# Altium schematic sheet 4bit_decoder.SchDoc
size OrCAD D; SheetNumber: 1; SheetTotal: 1
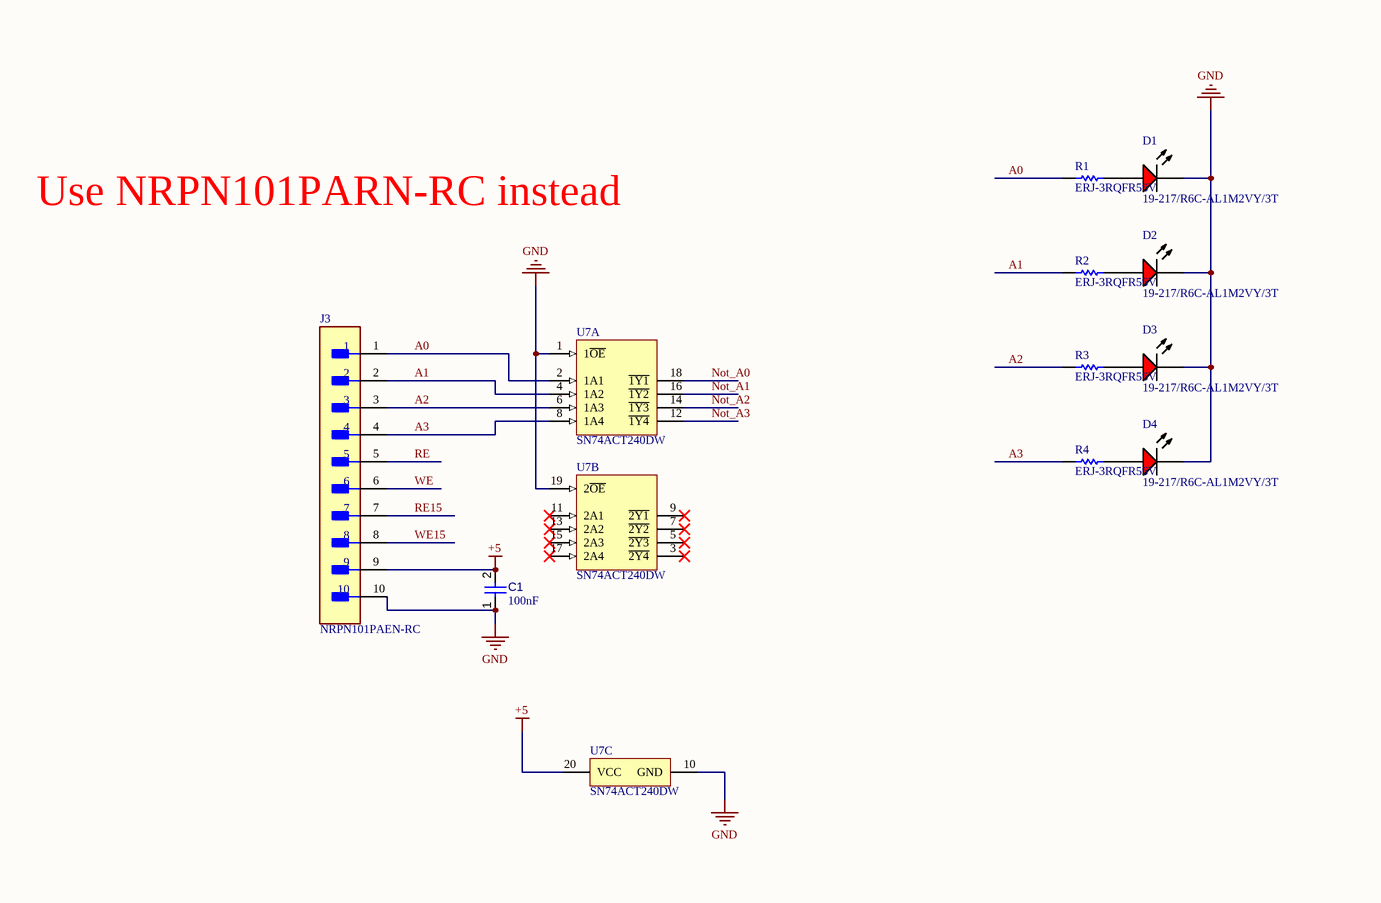
[diagram p0: 4bit_decoder.SchDoc, top left]
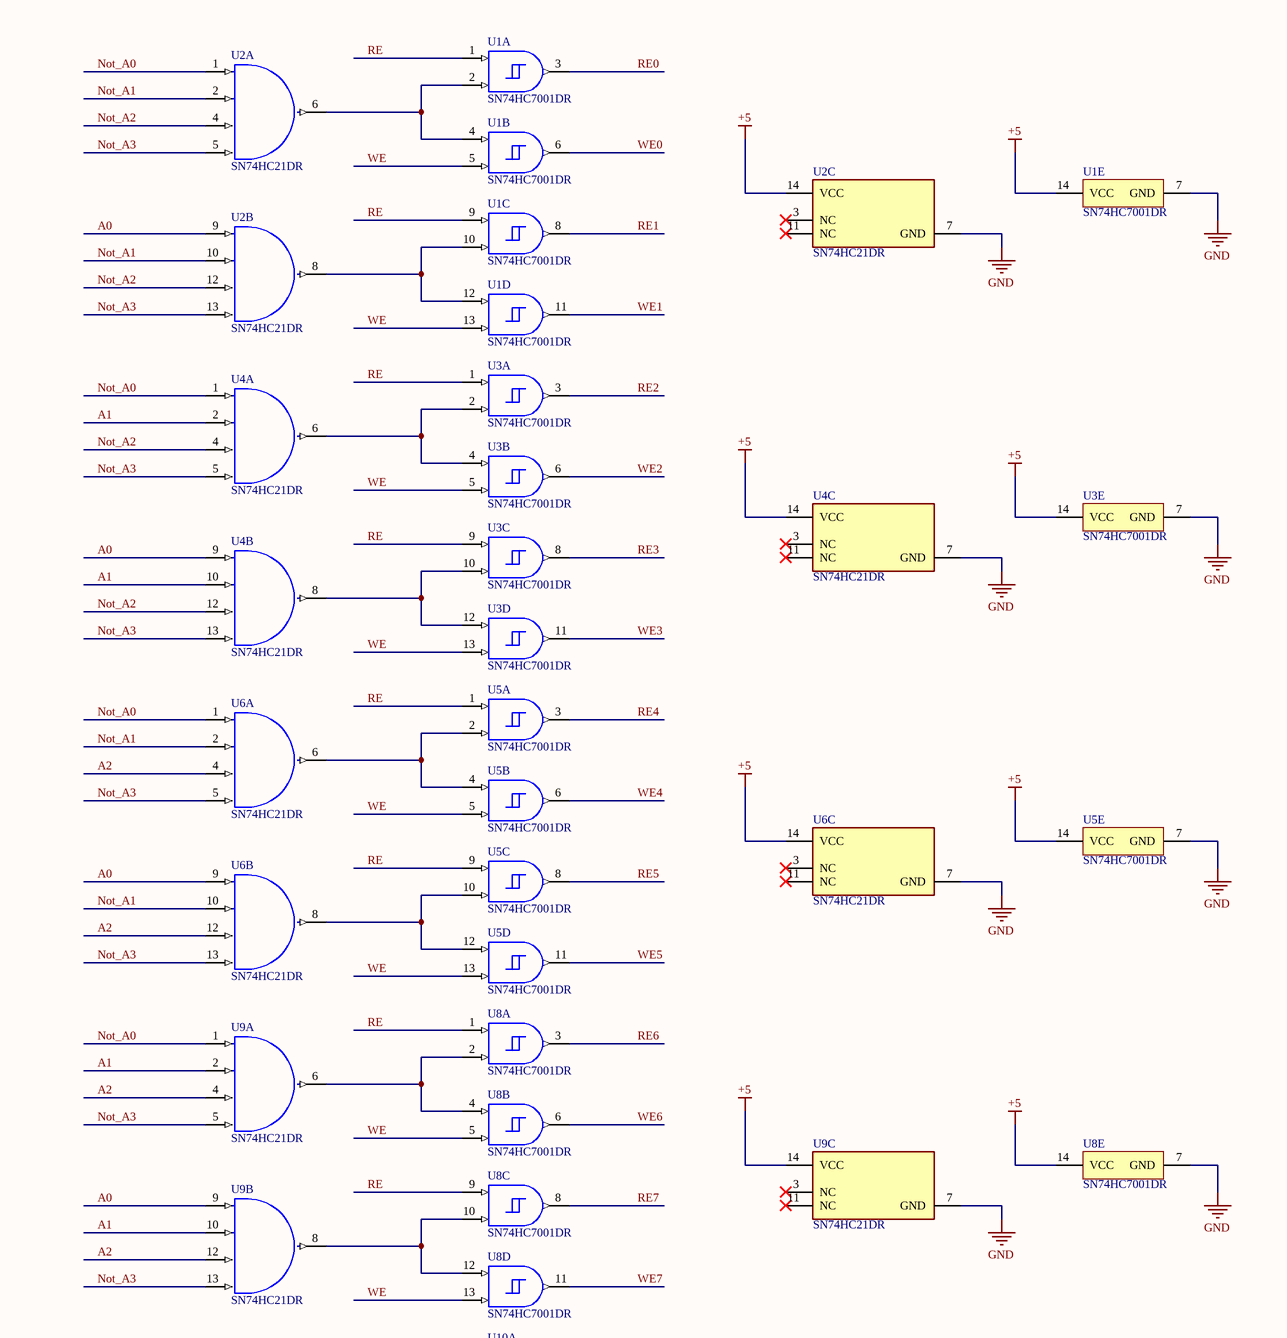
[diagram p1: 4bit_decoder.SchDoc, top middle]
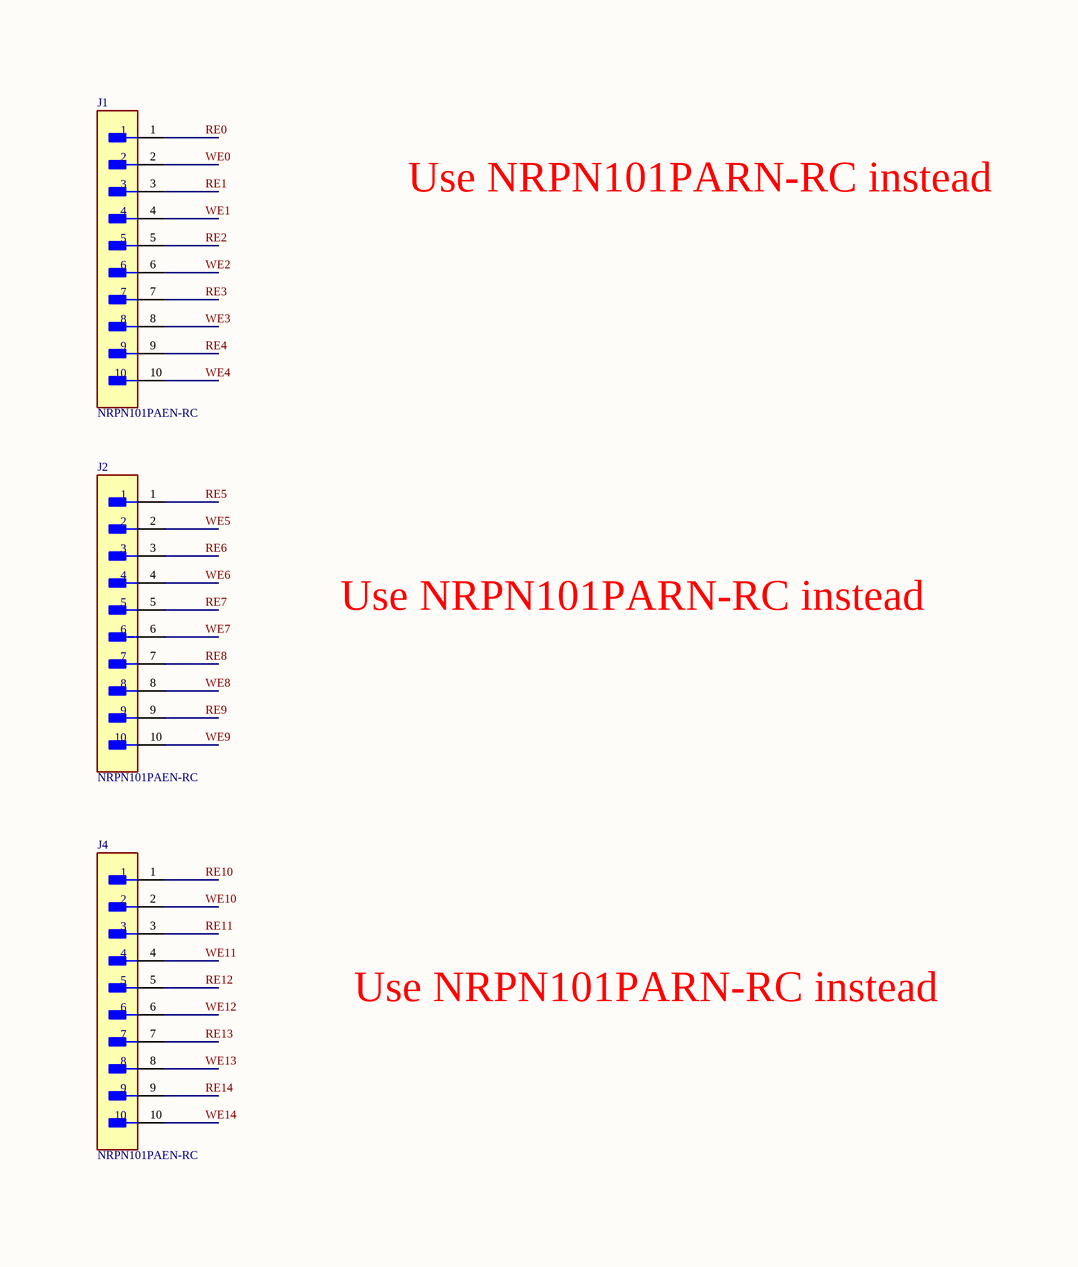
[diagram p2: 4bit_decoder.SchDoc, top right]
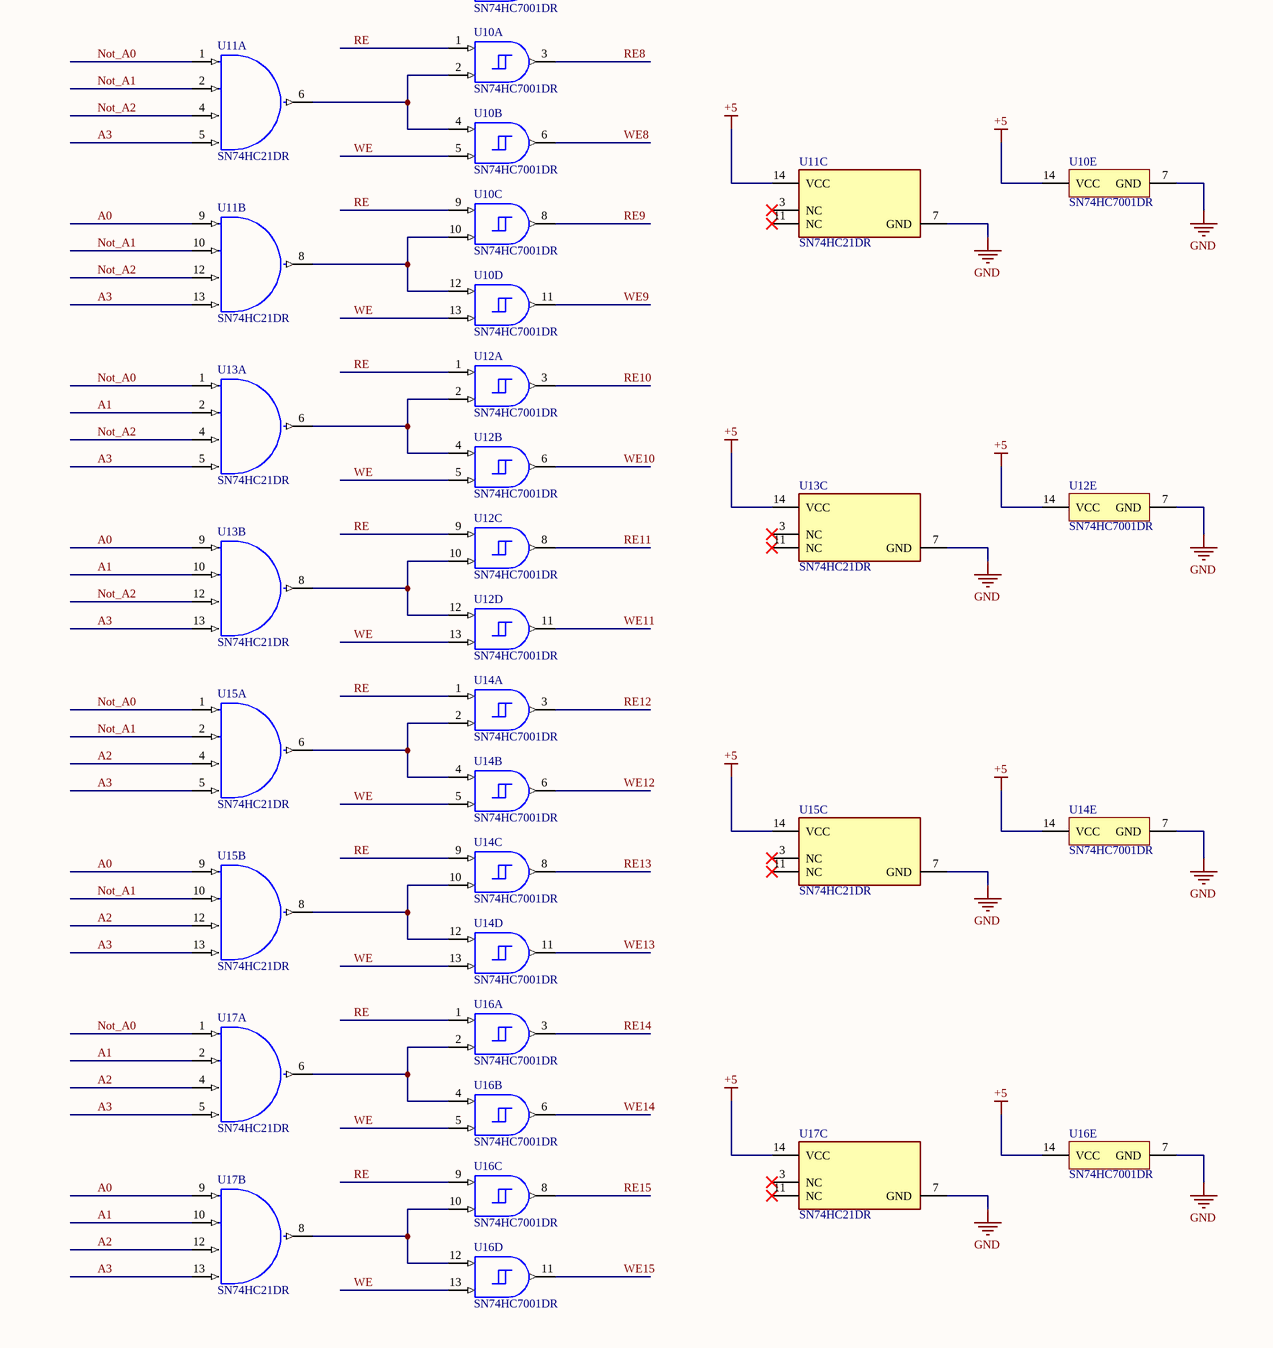
[diagram p3: 4bit_decoder.SchDoc, bottom middle]

## Parts
C1  value 100nF  [CAPC1608X90X40NL10T20]  (hidden comment: Capacitor 100 nF +/-10% 50 V 0603)
D1  19-217/R6C-AL1M2VY/3T  [EVRL-0603-2_V]
D2  19-217/R6C-AL1M2VY/3T  [EVRL-0603-2_V]
D3  19-217/R6C-AL1M2VY/3T  [EVRL-0603-2_V]
D4  19-217/R6C-AL1M2VY/3T  [EVRL-0603-2_V]
J1  NRPN101PAEN-RC  [FP-NRPN101PAEN-RC-MFG]
J2  NRPN101PAEN-RC  [FP-NRPN101PAEN-RC-MFG]
J3  NRPN101PAEN-RC  [FP-NRPN101PAEN-RC-MFG]
J4  NRPN101PAEN-RC  [FP-NRPN101PAEN-RC-MFG]
R1  ERJ-3RQFR56V  [RESC1608X55X30NL15T15]
R2  ERJ-3RQFR56V  [RESC1608X55X30NL15T15]
R3  ERJ-3RQFR56V  [RESC1608X55X30NL15T15]
R4  ERJ-3RQFR56V  [RESC1608X55X30NL15T15]
U1  SN74HC7001DR  [D0014A_L]  (parts A,B,C,D,E of 5)
U2  SN74HC21DR  [FP-D0014A-MFG]  (parts A,B,C of 3)
U3  SN74HC7001DR  [D0014A_L]  (parts A,B,C,D,E of 5)
U4  SN74HC21DR  [FP-D0014A-MFG]  (parts A,B,C of 3)
U5  SN74HC7001DR  [D0014A_L]  (parts A,B,C,D,E of 5)
U6  SN74HC21DR  [FP-D0014A-MFG]  (parts A,B,C of 3)
U7  SN74ACT240DW  [DW0020A_M]  (parts A,B,C of 3)
U8  SN74HC7001DR  [D0014A_L]  (parts A,B,C,D,E of 5)
U9  SN74HC21DR  [FP-D0014A-MFG]  (parts A,B,C of 3)
U10  SN74HC7001DR  [D0014A_L]  (parts A,B,C,D,E of 5)
U11  SN74HC21DR  [FP-D0014A-MFG]  (parts A,B,C of 3)
U12  SN74HC7001DR  [D0014A_L]  (parts A,B,C,D,E of 5)
U13  SN74HC21DR  [FP-D0014A-MFG]  (parts A,B,C of 3)
U14  SN74HC7001DR  [D0014A_L]  (parts A,B,C,D,E of 5)
U15  SN74HC21DR  [FP-D0014A-MFG]  (parts A,B,C of 3)
U16  SN74HC7001DR  [D0014A_L]  (parts A,B,C,D,E of 5)
U17  SN74HC21DR  [FP-D0014A-MFG]  (parts A,B,C of 3)

## Nets
+5: C1.2 J3.9 U1.14(VCC) U2.14(VCC) U3.14(VCC) U4.14(VCC) U5.14(VCC) U6.14(VCC) U7.20(VCC) U8.14(VCC) U9.14(VCC) U10.14(VCC) U11.14(VCC) U12.14(VCC) U13.14(VCC) U14.14(VCC) U15.14(VCC) U16.14(VCC) U17.14(VCC)
GND: C1.1 D1.2(K) D2.2(K) D3.2(K) D4.2(K) J3.10 U1.7(GND) U2.7(GND) U3.7(GND) U4.7(GND) U5.7(GND) U6.7(GND) U7.1(1~{OE}) U7.10(GND) U7.19(2~{OE}) U8.7(GND) U9.7(GND) U10.7(GND) U11.7(GND) U12.7(GND) U13.7(GND) U14.7(GND) U15.7(GND) U16.7(GND) U17.7(GND)
A0: J3.1 R1.1 U2.9(2A) U4.9(2A) U6.9(2A) U7.2(1A1) U9.9(2A) U11.9(2A) U13.9(2A) U15.9(2A) U17.9(2A)
A1: J3.2 R2.1 U4.2(1B) U4.10(2B) U7.4(1A2) U9.2(1B) U9.10(2B) U13.2(1B) U13.10(2B) U17.2(1B) U17.10(2B)
A2: J3.3 R3.1 U6.4(1C) U6.12(2C) U7.6(1A3) U9.4(1C) U9.12(2C) U15.4(1C) U15.12(2C) U17.4(1C) U17.12(2C)
A3: J3.4 R4.1 U7.8(1A4) U11.5(1D) U11.13(2D) U13.5(1D) U13.13(2D) U15.5(1D) U15.13(2D) U17.5(1D) U17.13(2D)
Not_A0: U2.1(1A) U4.1(1A) U6.1(1A) U7.18(~{1Y1}) U9.1(1A) U11.1(1A) U13.1(1A) U15.1(1A) U17.1(1A)
Not_A1: U2.2(1B) U2.10(2B) U6.2(1B) U6.10(2B) U7.16(~{1Y2}) U11.2(1B) U11.10(2B) U15.2(1B) U15.10(2B)
Not_A2: U2.4(1C) U2.12(2C) U4.4(1C) U4.12(2C) U7.14(~{1Y3}) U11.4(1C) U11.12(2C) U13.4(1C) U13.12(2C)
Not_A3: U2.5(1D) U2.13(2D) U4.5(1D) U4.13(2D) U6.5(1D) U6.13(2D) U7.12(~{1Y4}) U9.5(1D) U9.13(2D)
RE: J3.5 U1.1(1A) U1.9(3A) U3.1(1A) U3.9(3A) U5.1(1A) U5.9(3A) U8.1(1A) U8.9(3A) U10.1(1A) U10.9(3A) U12.1(1A) U12.9(3A) U14.1(1A) U14.9(3A) U16.1(1A) U16.9(3A)
RE0: J1.1 U1.3(1Y)
RE1: J1.3 U1.8(3Y)
RE2: J1.5 U3.3(1Y)
RE3: J1.7 U3.8(3Y)
RE4: J1.9 U5.3(1Y)
RE5: J2.1 U5.8(3Y)
RE6: J2.3 U8.3(1Y)
RE7: J2.5 U8.8(3Y)
RE8: J2.7 U10.3(1Y)
RE9: J2.9 U10.8(3Y)
RE10: J4.1 U12.3(1Y)
RE11: J4.3 U12.8(3Y)
RE12: J4.5 U14.3(1Y)
RE13: J4.7 U14.8(3Y)
RE14: J4.9 U16.3(1Y)
RE15: J3.7 U16.8(3Y)
WE: J3.6 U1.5(2B) U1.13(4B) U3.5(2B) U3.13(4B) U5.5(2B) U5.13(4B) U8.5(2B) U8.13(4B) U10.5(2B) U10.13(4B) U12.5(2B) U12.13(4B) U14.5(2B) U14.13(4B) U16.5(2B) U16.13(4B)
WE0: J1.2 U1.6(2Y)
WE1: J1.4 U1.11(4Y)
WE2: J1.6 U3.6(2Y)
WE3: J1.8 U3.11(4Y)
WE4: J1.10 U5.6(2Y)
WE5: J2.2 U5.11(4Y)
WE6: J2.4 U8.6(2Y)
WE7: J2.6 U8.11(4Y)
WE8: J2.8 U10.6(2Y)
WE9: J2.10 U10.11(4Y)
WE10: J4.2 U12.6(2Y)
WE11: J4.4 U12.11(4Y)
WE12: J4.6 U14.6(2Y)
WE13: J4.8 U14.11(4Y)
WE14: J4.10 U16.6(2Y)
WE15: J3.8 U16.11(4Y)
NetD1_1: D1.1(A) R1.2
NetD2_1: D2.1(A) R2.2
NetD3_1: D3.1(A) R3.2
NetD4_1: D4.1(A) R4.2
NetU1_2: U1.2(1B) U1.4(2A) U2.6(1Y)
NetU1_10: U1.10(3B) U1.12(4A) U2.8(2Y)
NetU3_2: U3.2(1B) U3.4(2A) U4.6(1Y)
NetU3_10: U3.10(3B) U3.12(4A) U4.8(2Y)
NetU5_2: U5.2(1B) U5.4(2A) U6.6(1Y)
NetU5_10: U5.10(3B) U5.12(4A) U6.8(2Y)
NetU8_2: U8.2(1B) U8.4(2A) U9.6(1Y)
NetU8_10: U8.10(3B) U8.12(4A) U9.8(2Y)
NetU10_2: U10.2(1B) U10.4(2A) U11.6(1Y)
NetU10_10: U10.10(3B) U10.12(4A) U11.8(2Y)
NetU12_2: U12.2(1B) U12.4(2A) U13.6(1Y)
NetU12_10: U12.10(3B) U12.12(4A) U13.8(2Y)
NetU14_2: U14.2(1B) U14.4(2A) U15.6(1Y)
NetU14_10: U14.10(3B) U14.12(4A) U15.8(2Y)
NetU16_2: U16.2(1B) U16.4(2A) U17.6(1Y)
NetU16_10: U16.10(3B) U16.12(4A) U17.8(2Y)

Not connected (* = marked no-connect by the designer): U2 3(NC)* 11(NC)*; U4 3(NC)* 11(NC)*; U6 3(NC)* 11(NC)*; U7 3(~{2Y4})* 5(~{2Y3})* 7(~{2Y2})* 9(~{2Y1})* 11(2A1)* 13(2A2)* 15(2A3)* 17(2A4)*; U9 3(NC)* 11(NC)*; U11 3(NC)* 11(NC)*; U13 3(NC)* 11(NC)*; U15 3(NC)* 11(NC)*; U17 3(NC)* 11(NC)*

## Notes on the sheet
- Use NRPN101PARN-RC instead

## Library data of the parts
C1 = CMP-001-00017-6: Chip Capacitor, 100 nF, +/- 10%, 50 V, 0603 (1608 Metric); Voltage Rating: 50V; Capacitor Type: Ceramic; Tolerance: 10%; Mounting Technology: SM; Max Operating Temperature: 125°C; RoHS Compliant: True; Pins: 2; Case/Package: 0603; Min Operating Temperature: -55°C
D1-D4 = CMP-007-00004-2: Chip LED, Red, 5 V, 25 mA, -40 to 85 degC, 2-Pin SMD (0603), RoHS, Tape and Reel; Manufacturer: Everlight Electronics; Forward Voltage: 2.2V; Lens Style: Clear; Package Reference: 0603; Datasheet Version: Rev. 1, 01/2005; Mounting Technology: SM; RoHS Compliant: False; Datasheet URL: https://datasheet.ciiva.com/4688/el-19-217-r6c-al1m2vy-3tpdf-187026-4688713.pdf; Case/Package: 0603; Colour: Red; Manufacturer URL: http://www.everlight.com/; Package Description: 2-Pin Surface Mount Device, Body 1.6 x 0.8 mm
J1-J4 = CMP-25680-000006-1: CONN HEADER VERT 10POS 2MM; Manufacturer: Sullins; Current Rating: 2A; Conn Gender: Male; Voltage Rating: 150V; Conn Orientation: Straight; Number Of Contacts: 10; Temperature: -40°C to +105°C; Manufacturer Part Number: NRPN101PAEN-RC; Package: 0; Lead Free: Yes; Device Class L3: unset; Octopart: https://octopart.com/nrpn101paen-rc-sullins-18674398; Device Class L1: Connectors; Contact Material: Gold,Nickel; ComponentLink2URL: https://s3.amazonaws.com/catalogspreads-pdf/PAGE104-105%202mm%20MALE%20HDR%20ST%20RA%20SMT.pdf; Footprint Url: https://drawings-pdf.s3.amazonaws.com/10531.pdf; Height: 5.95mm; Digikey Description: CONN HEADER VERT 10POS 2MM; Category: Conn; Automotive: No; Number Of Rows: 1; Device Class L2: Headers and Wire Housings; Temperature Range High: +105°C; Temperature Range Low: -40°C; Pitch: 2mm; RoHS: TRUE; ComponentLink2Description: Datasheet
R1-R4 = CMP-2000-00858-1: Manufacturer: Panasonic; Part Number: ERJ-3RQFR56V
U1 U3 U5 U8 U10 U12 U14 U16 = CMP-016-00014-1: 4-ch, 4-input 2-V to 6-V 5.2-mA drive strength AND gate with Schmitt-Trigger inputs 14-SOIC -40 to 85
U2 U4 U6 U9 U11 U13 U15 U17 = CMP-016-00017-1: 2-ch, 4-input, 2-V to 6-V 5.2 mA drive strength AND gate 14-SOIC -40 to 85
U7 = CMP-016-00012-1: Buffer/Line Driver 8-Channel Inverting 3-Straight CMOS 20-Pin SOIC